# EAGLE design ESP32-Wrover-DevBoard (EAGLE 6.5.0)
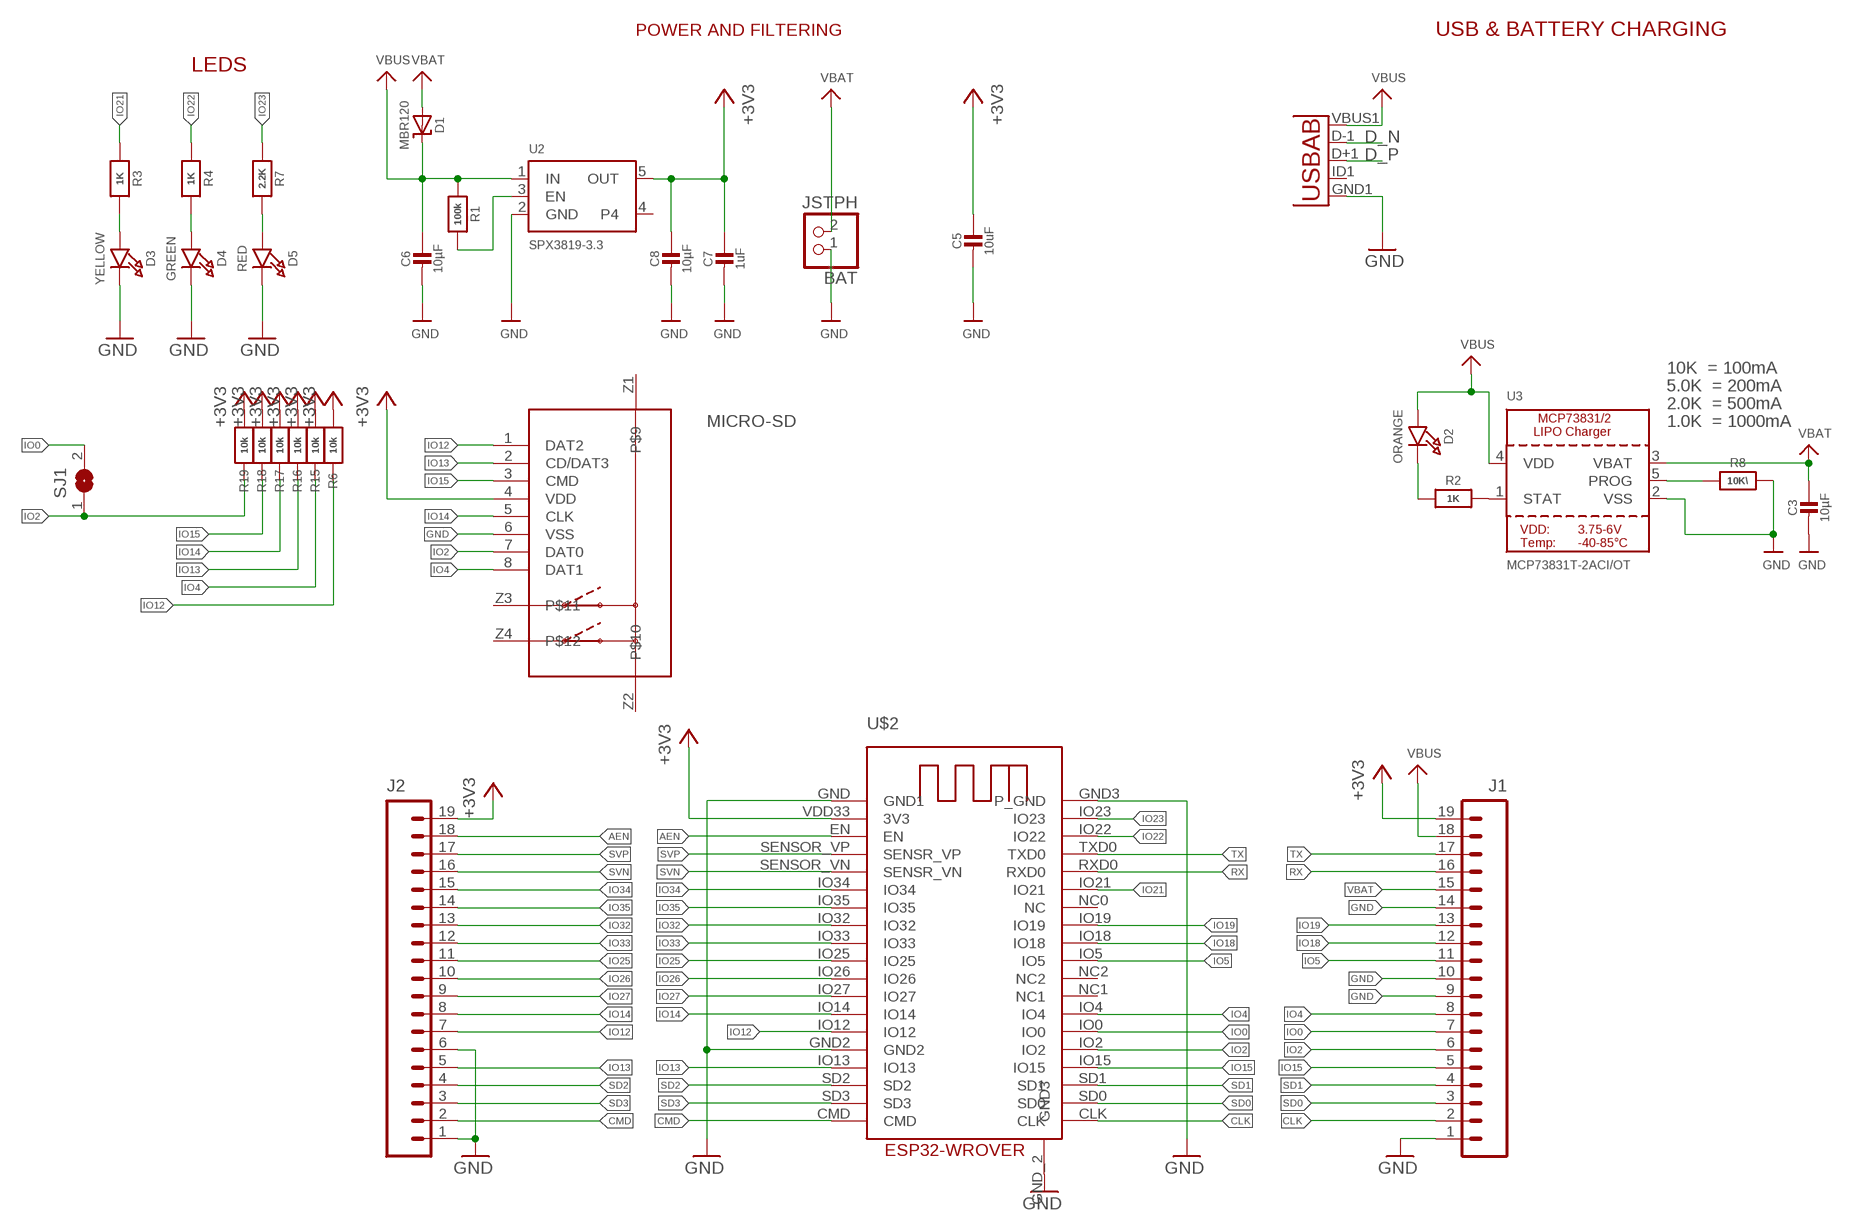
[diagram p0: schematic, sheet 1, part 1 of 2]
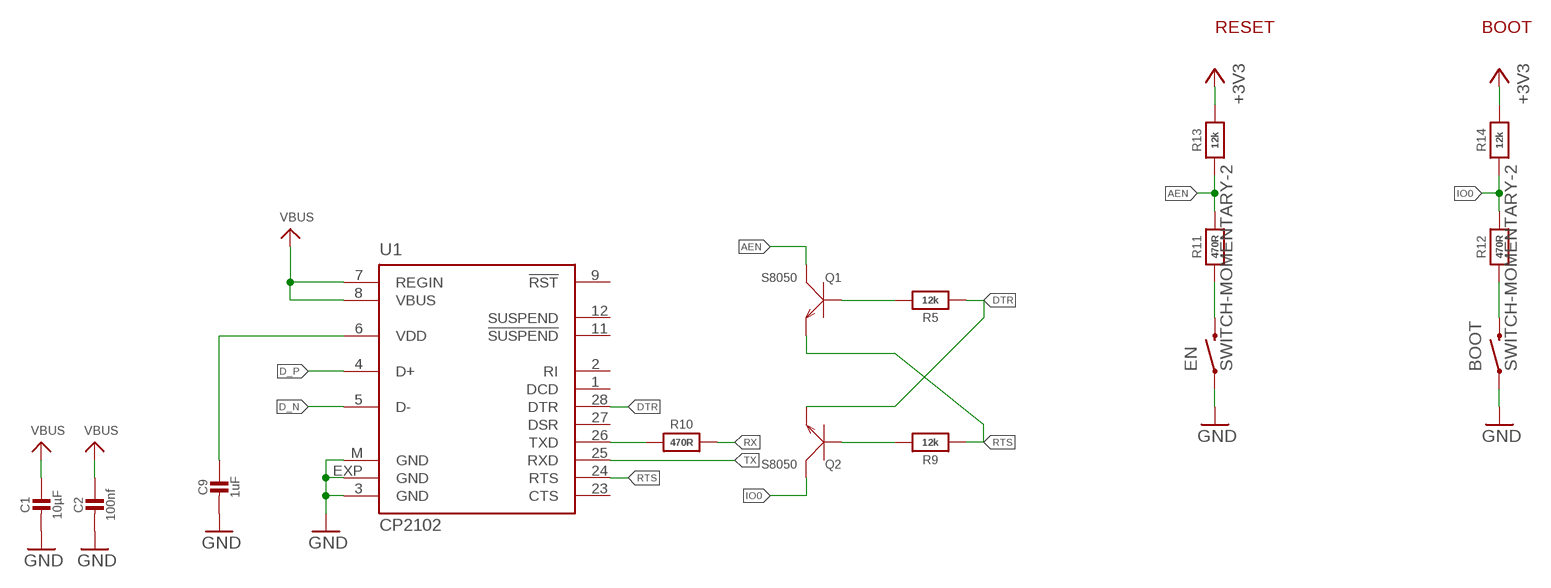
[diagram p1: schematic, sheet 1, part 2 of 2]

## Parts
BAT  JSTPH  CON_JST_PH_2PIN  [JSTPH2]
BOOT  SWITCH-MOMENTARY-2  [WS-TRS-6.0X3.5MM-TACT-SWITCH_SMD]
C1  10µF  CAP_CERAMIC0805-NOOUTLINE  [0805-NO]
C2  100nf  CAP_CERAMIC0603_NO  [0603-NO]
C3  10µF  CAP_CERAMIC0805-NOOUTLINE  [0805-NO]
C5  10uF  CAP_CERAMIC0805-NOOUTLINE  [0805-NO]
C6  10µF  CAP_CERAMIC0805-NOOUTLINE  [0805-NO]
C7  1uF  CAP_CERAMIC0603_NO  [0603-NO]
C8  10µF  CAP_CERAMIC0805-NOOUTLINE  [0805-NO]
C9  1uF  CAP_CERAMIC0603_NO  [0603-NO]
D1  MBR120  DIODE-SCHOTTKYSOD-123  [SOD-123]
D2  ORANGE  LED0805_NOOUTLINE  [CHIPLED_0805_NOOUTLINE]
D3  YELLOW  LED0805_NOOUTLINE  [CHIPLED_0805_NOOUTLINE]
D4  GREEN  LED0805_NOOUTLINE  [CHIPLED_0805_NOOUTLINE]
D5  RED  LED0805_NOOUTLINE  [CHIPLED_0805_NOOUTLINE]
EN  SWITCH-MOMENTARY-2  [WS-TRS-6.0X3.5MM-TACT-SWITCH_SMD]
J1  M191X19_NO_SILK  [1X19_NO_SILK]
J2  M191X19_NO_SILK  [1X19_NO_SILK]
M-USB  USB""  [USB-MICRO-SMD]
MICRO-SD  693072010801  [693072010801]
Q1  S8050  SMD-TRANSISTORS-NPN-25V-500MW-S8050(SOT-23)  [SOT-23]
Q2  S8050  SMD-TRANSISTORS-NPN-25V-500MW-S8050(SOT-23)  [SOT-23]
R1  100k  RESISTOR_0603_NOOUT  [0603-NO]
R2  1K  RESISTOR_0603_NOOUT  [0603-NO]
R3  1K  RESISTOR_0603_NOOUT  [0603-NO]
R4  1K  RESISTOR_0603_NOOUT  [0603-NO]
R5  12k  RESISTOR_0603_NOOUT  [0603-NO]
R6  10k  RESISTOR_0603_NOOUT  [0603-NO]
R7  2.2K  RESISTOR_0603_NOOUT  [0603-NO]
R8  10K\  RESISTOR_0603_NOOUT  [0603-NO]
R9  12k  RESISTOR_0603_NOOUT  [0603-NO]
R10  470R  RESISTOR_0603_NOOUT  [0603-NO]
R11  470R  RESISTOR_0603_NOOUT  [0603-NO]
R12  470R  RESISTOR_0603_NOOUT  [0603-NO]
R13  12k  RESISTOR_0603_NOOUT  [0603-NO]
R14  12k  RESISTOR_0603_NOOUT  [0603-NO]
R15  10k  RESISTOR_0603_NOOUT  [0603-NO]
R16  10k  RESISTOR_0603_NOOUT  [0603-NO]
R17  10k  RESISTOR_0603_NOOUT  [0603-NO]
R18  10k  RESISTOR_0603_NOOUT  [0603-NO]
R19  10k  RESISTOR_0603_NOOUT  [0603-NO]
SJ1  SJ  [SJ]
U1  CP2102  [MLP28]
U2  SPX3819-3.3  VREG_SOT23-5  [SOT23-5]
U3  MCP73831T-2ACI/OT  MCP73831/2  [SOT23-5]
U$2  ESP32-WROVER  [ESP32-WROVER]

## Nets
+3V3: C5.1 C7.1 C8.1 J1.19 J2.19 MICRO-SD.4(VDD) R6.1 R13.2 R14.2 R15.1 R16.1 R17.1 R18.1 R19.1 U2.5(OUT) U$2.VDD33(3V3)
AEN: J2.18 Q1.3(C) R11.2 R13.1 U$2.EN
CLK: J1.2 U$2.CLK
CMD: J2.2 U$2.CMD
D_N: M-USB.D-1(D-) U1.5(D-)
D_P: M-USB.D+1(D+) U1.4(D+)
DTR: Q2.2(E) R5.1 U1.28(DTR)
GND: BAT.1 BOOT.1 C1.2 C2.2 C3.2 C5.2 C6.2 C7.2 C8.2 C9.2 D3.C D4.C D5.C EN.1 J1.1 J1.9 J1.10 J1.14 J2.1 J2.6 M-USB.GND1(GND) MICRO-SD.6(VSS) R8.2 U1.3(GND) U1.EXP(GND) U1.M(GND) U2.2(GND) U3.2(VSS) U$2.GND2 U$2.GND3(P_GND) U$2.GND(GND1) U$2.GND_2(GND3)
IO0: J1.7 Q2.3(C) R12.2 R14.1 SJ1.2 U$2.IO0
IO2: J1.6 MICRO-SD.7(DAT0) R19.2 SJ1.1 U$2.IO2
IO4: J1.8 MICRO-SD.8(DAT1) R15.2 U$2.IO4
IO5: J1.11 U$2.IO5
IO12: J2.7 MICRO-SD.1(DAT2) R6.2 U$2.IO12
IO13: J2.5 MICRO-SD.2(CD/DAT3) R16.2 U$2.IO13
IO14: J2.8 MICRO-SD.5(CLK) R17.2 U$2.IO14
IO15: J1.5 MICRO-SD.3(CMD) R18.2 U$2.IO15
IO18: J1.12 U$2.IO18
IO19: J1.13 U$2.IO19
IO21: R3.1 U$2.IO21
IO22: R4.1 U$2.IO22
IO23: R7.1 U$2.IO23
IO25: J2.11 U$2.IO25
IO26: J2.10 U$2.IO26
IO27: J2.9 U$2.IO27
IO32: J2.13 U$2.IO32
IO33: J2.12 U$2.IO33
IO34: J2.15 U$2.IO34
IO35: J2.14 U$2.IO35
N$1: D2.C R2.1
N$2: D5.A R7.2
N$3: R2.2 U3.1(STAT)
N$4: R8.1 U3.5(PROG)
N$5: R10.1 U1.26(TXD)
N$6: D4.A R4.2
N$7: Q1.1(B) R5.2
N$8: Q2.1(B) R9.2
N$9: C9.1 U1.6(VDD)
N$10: EN.2 R11.1
N$11: BOOT.2 R12.1
N$12: D3.A R3.2
NX1: R1.2 U2.3(EN)
RTS: Q1.2(E) R9.1 U1.24(RTS)
RX: J1.16 R10.2 U$2.RXD0
SD0: J1.3 U$2.SD0
SD1: J1.4 U$2.SD1
SD2: J2.4 U$2.SD2
SD3: J2.3 U$2.SD3
SVN: J2.16 U$2.SENSOR_VN(SENSR_VN)
SVP: J2.17 U$2.SENSOR_VP(SENSR_VP)
TX: J1.17 U1.25(RXD) U$2.TXD0
VBAT [vbat]: BAT.2 C3.1 D1.A J1.15 U3.3(VBAT)
VBUS [vbat]: C1.1 C2.1 C6.1 D1.C D2.A J1.18 M-USB.VBUS1(VBUS) R1.1 U1.7(REGIN) U1.8(VBUS) U2.1(IN) U3.4(VDD)
Unconnected: M-USB.ID1(USBID) MICRO-SD.Z1 MICRO-SD.Z2 MICRO-SD.Z3 MICRO-SD.Z4 U1.1(DCD) U1.2(RI) U1.9(!RST) U1.11(!SUSPEND) U1.12(SUSPEND) U1.23(CTS) U1.27(DSR) U2.4 U$2.NC0(NC) U$2.NC1 U$2.NC2

## Notes on the sheet
- RESET | BOOT
- POWER AND FILTERING | USB & BATTERY CHARGING
- LEDS
- 10K  = 100mA
- 5.0K  = 200mA
- 2.0K  = 500mA
- 1.0K  = 1000mA

## Library data of the parts
BAT = microbuilder:CON_JST_PH_2PIN: JST 2-Pin Right-Angle Connector PH-Series - 4UConnector: 17311 SH-Series - 4UConnector: 07278
BOOT EN = SparkFun-Electromechanical:SWITCH-MOMENTARY-2: Various NO switches- pushbuttons, reed, etc Note: WS-TRS-6.0x3.5mm-Tact-Switch_SMD package belongs to https://www.conrad.de/de/drucktaster-12-vdc-005-a-1-x-ausein-wuerth-elektronik-ws-tsw-434111050826-tastend-1-st-711749.html?sc.ref=Product%20Details; CONRAD-WEB-LINK: https://www.conrad.de/de/drucktaster-12-vdc-005-a-1-x-ausein-wuerth-elektronik-ws-tsw-434111050826-tastend-1-st-711749.html?sc.ref=Product%20Details
C1-C3 C5-C9 = microbuilder:CAP_CERAMIC: Ceramic Capacitors For new designs, use the packages preceded by an '_' character since they are more reliable: The following footprints should be used on most boards: _0402 - Standard footprint for regular board layouts _0603 - Standard footprint for regular board layouts _0805 - Standard footprint for regular board layouts _1206 - Standard footprint for regular board layouts For extremely tight-pitch boards where space is at a premium, the following 'micro-pitch' footprints can be used (smaller pads, no silkscreen outline, etc.): _0402MP - Micro-pitch footprint for very dense/compact boards _0603MP - Micro-pitch footprint for very dense/compact boards _0805MP - Micro-pitch footprint for very dense/compact boards _1206MP - Micro-pitch footprint for very dense/compact boards
D1 = microbuilder:DIODE-SCHOTTKY
D2-D5 = microbuilder:LED: LED 0603 - 0603 Surface Mount Package 2mA: Green LED - Low Power (3.9mcd, 2ma, 1.7Vf) - Digikey: 475-2709-2-ND Orange LED - Low Power (9.8mcd, 2ma, 1.8Vf) - Digikey: 475-1194-2-ND Red LED - Low Power (5mcd, 2ma, 1.8Vf) - Digikey: 475-1195-2-ND Yellow LED - Low Power (7mcd, 2ma, 1.8Vf) - Digikey: 475-1196-2-ND 5mA: Blue LED - Low Power (17mcd, 5ma, 2.9Vf) - Digikey: LNJ937W8CRACT-ND 0805 - 0805 Surface Mount Package 2mA: Red LED (8.8mcd, 2mA, 1.8Vf, Clear) - Low Power [Digikey: 475-2510-1-ND] Green LED (5mcd, 2mA, 1.8Vf, Clear) - Low Power [Digikey: 475-2730-1-ND] Yellow LED (11.3mcd, 2mA, 1.8Vf, Clear) - Low Power [Digikey: 475-2555-1-ND] 20mA: Red LED (104mcd, 20mA, Diffused) - LS R976 [Digikey: 475-1278-6-ND] Red LED (12mcd, 20mA, 2.0Vf, Clear) - APT2012EC [Digikey: 754-1128-1-ND] Green LED (15mcd, 20mA, 2.2Vf, Clear) - APT2012GC [Digikey: 754-1131-1-ND] Orange LED (160mcd, 20mA, 2.1Vf, Clear) - APT2012SECK [Digikey: 754-1130-1-ND] 1206 - 1206 Surface Mount Package Green LED (26mcd, 20mA, Diffused) - LG N971 [Digikey: 475-1407-6-ND] Red LED (15mcd, 20mA, Diffused) - LH N974 [Digikey: 475-1416-6-ND] Cree - Cree High-Power Surface Mount LEDs XPEBWT-L1-0000-00D50 - White 111lm 350mA 2.9Vf 6200K 110° XTEAWT-00-0000-00000LEE3 - White 114lm 350mA 2.85Vf 5000K 115° Everlight - Everlight 45-21 Series Surface Mount LEDs 45-21/QK2C-B2832AC2CB2/2T - Warm White 2000mcd 20mA 3.25Vf 3050K 120° 45-21/LK2C-B38452C4CB2/2T - Nuetral White 2000mcd 20mA 3.25Vf 4150K 120° 45-21/LK2C-B50634C6CB2/2T - Cold White 2200mcd 20mA 3.25Vf 5650K 120° PLCC2 Reverse Mount LS T77K-J1L2-1-0-2-R18-Z - Red 11.25mcd 2mA 1.8Vf 630nm 120° LO T77K-L1M2-24-Z - Orange 19.6mcd 2mA 1.8Vf 606nm 120° LY T77K-K2M1-26-Z - Yellow 15.7mcd 2mA 1.8Vf 587nm 120°
J1 J2 = SparkFun-Connectors:M19: 1x19 .1" header
M-USB = MicroUSB:USB: This is a USB AB connector that is compatible with USB OTG. i.e. this connector can serve as a host or device..... Micro USB female connector, horizontal mounting 207A-BBA0-R Micro USB female connector TYP B Attend content ......... https://www.conrad.de/de/micro-usb-einbaubuchse-buchse-einbau-horizontal-207a-bba0-r-micro-usb-einbaubuchse-typ-b-attend-inhalt-1-st-1307069.html
MICRO-SD = Wurth_Elektronik_Electromechanic_Input-Output_Connectors_rev16b:693072010801: WR-CRD MICRO SD CARD CONNECTOR HINGE 8PINS=>Code : Con_I-O_COM_CRD_SD_Micro_696072010801 <http://katalog.we-online.de/media/images/eican/Con_I-O_COM_CRD_SD_Micro_696072010801_pf2.jpg> Details see: http://katalog.we-online.de/en/em/693_072_010_801 Created 2014-07-09, Karrer Zheng 2014 (C) Würth Elektronik; CONRAD-WEB-LINK: https://www.conrad.de/de/wr-crd-micro-sd-kartensockel-mit-deckel-8-pins-pole-8-wuerth-elektronik-inhalt-1-st-1088844.html
Q1 Q2 = Seeed-Transistor:SMD-TRANSISTORS-NPN-25V-500MW-S8050(SOT-23): 305010017; MPN: S8050
R1-R19 = microbuilder:RESISTOR: Resistors For new designs, use the packages preceded by an '_' character since they are more reliable: The following footprints should be used on most boards: _0402 - Standard footprint for regular board layouts _0603 - Standard footprint for regular board layouts _0805 - Standard footprint for regular board layouts _1206 - Standard footprint for regular board layouts For extremely tight-pitch boards where space is at a premium, the following 'micro-pitch' footprints can be used (smaller pads, no silkscreen outline, etc.): _0402MP - Micro-pitch footprint for very dense/compact boards _0603MP - Micro-pitch footprint for very dense/compact boards _0805MP - Micro-pitch footprint for very dense/compact boards _1206MP - Micro-pitch footprint for very dense/compact boards
SJ1 = jumper:SJ: SMD solder JUMPER
U1 = silabs:CP210*: Single-Chip USB to UART Bridge Source: www.silabs.com .. CP2101.pdf / cp2102.pdf; MF: FARNELL; MPN: CP2102-GM; OC_FARNELL: 9282130; OC_NEWARK: 30K5635
U2 = microbuilder:VREG_SOT23-5: SOT23-5 Fixed Voltage Regulators Part Current Out V Out V In V Dropout θJA (°C/W) TJ (°C) Digikey Part No. ADP121 150mA 3.3V 3.4-5.5V 0.09V @ 150mA -- -- ADP121-AUJZ33R7CT-ND ADP121 150mA 3.0V 3.1-5.5V 0.09V @ 150mA -- -- ADP121-AUJZ30R7CT-ND ADP122 300mA 3.3V 3.4-5.5V 0.085V @ 300mA -- -- ADP122AUJZ-3.3-R7CT-ND ADP1712 300mA 3.3V 3.5-5.5V 0.17V @ 300mA -- -- ADP1712AUJZ-3.3-R7TR-ND AP7311 (Low Cost) 150mA 3.3V 3.5-6V 0.15V @ 150mA -- -- AP7311-33WG-7DICT-ND LD39015M18R 150mA 1.8V 1.9V-5.5V 0.08V @ 100mA -- -- 497-6977-1-ND LP2985A-33DBVR 150mA 3.3V 3.3-16V 0.28V @ 150mA 206 150 296-18479-1-ND MCP1824T-3302E/OT 300mA 3.3V 3.5V-6V 0.2V @ 300mA -- -- MCP1824T-3302E/OTCT-ND MIC5205-2.5YM5 TR 150mA 2.5V 2.7-16V 0.165V @ 150mA -- -- 576-1257-2-ND MIC5205-3.0YM5 TR 150mA 3.0V 3.2V-16V 0.165V @ 150mA -- -- 576-1258-2-ND MIC5205-3.3YM5 TR 150mA 3.3V 3.5V-16V 0.165V @ 150mA -- -- 576-1259-2-ND TPS780330220 150mA 3.3V+2.2V 3.6-5.5V 250mV Max -- -- 296-23332-1-ND TDA3663/N1,135 100mA 3.3V 3.5-45V 0.18V @ 50mA -- -- 568-5343-1-ND Max operating temp can be calculated using θJA, TJ (max junction temperature), and power in watts. Set the "Maximum Ambient Temperature" until it reaches TJ ("Max Junction Temperature"), which is the absolute limit for safe use of the regulator: Heat Sink Temperature Calculator <http://www.daycounter.com/Calculators/Heat-Sink-Temperature-Calculator.phtml> For example, With 12V source into a 3.3V LP2985 and a 30mA load, we are dissipating (12V-3.3V) * 0.03A = 0.261W. With a θJA of 206 °C/W, a TJ of 150°C, and 261mW we can safely use the chip without a heat sink up to 75°C (=147.1°C Junction Temperature).
U3 = microbuilder:MCP73831/2: MCP73831/2 LIPO Charger VDD: 3.75 - 6V Temp -40 - 85°C Programmable Charge Rate: 15-500mA NOTE: STAT is a tri-state logic output on the MCP73831 and an open-drain output on the MCP73832. SOT23-5 with 4.2V output and tri-state logic on STAT = MCP73831T-2ACI/OT; CONRAD-WEB-LINK: https://www.conrad.de/de/pmic-batteriemanagement-microchip-technology-mcp73831t-2aciot-lademanagement-li-ion-li-pol-sot-23-5-oberflaechenmonta-651521.html
U$2 = ESP32-Wrover:ESP32-WROVER

## Net classes
1 vbat: width 0.254 mm, drill 0.305 mm, clearance 0.152 mm

## Board
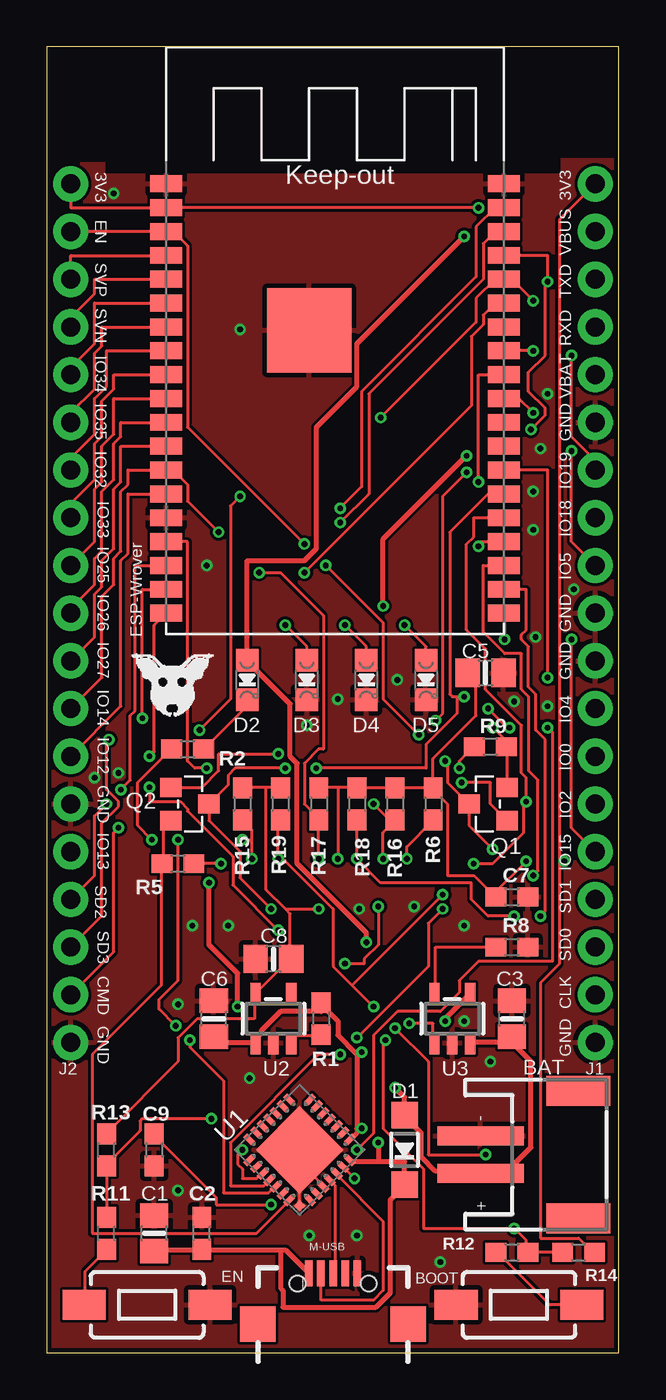
[diagram p2: board, top side]
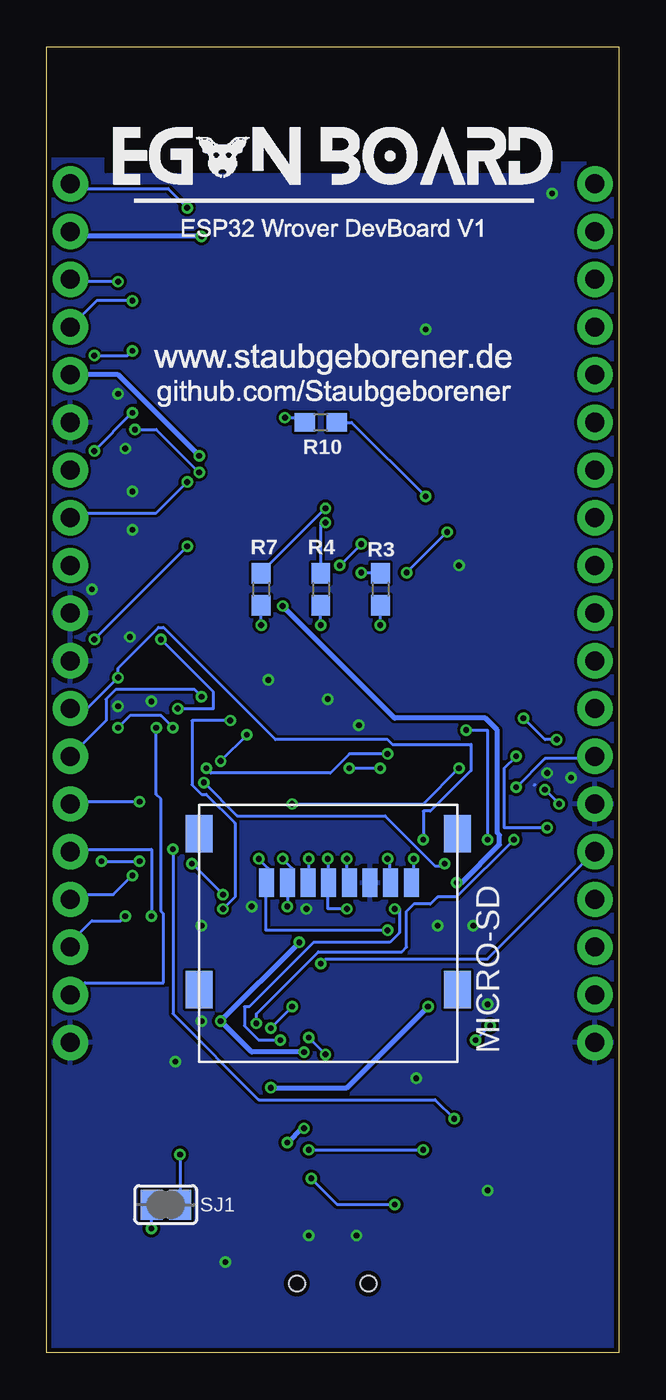
[diagram p3: board, bottom side, seen from below]

Size 30.46 x 69.52 mm. Coordinates in mm from the lower left corner, seen from the top.
Outline: 0,0 30.46,0 30.46,69.52 0,69.52 0,0
Copper layers (1*16): Top 0.035mm / dielectric 1.5mm / Bottom 0.035mm
Design rules "SeeedStudio_2layer_DRU_no_angle_20140221": minimum track width 6mil, minimum drill 12mil, track to track 6mil, track to pad 6mil, pad to pad 6mil, via to via 6mil, smd to smd 0mil, copper to edge 10mil, drill to drill 10mil, minimum pad ring 10mil, minimum via ring 6mil, stop-mask expansion 2mil, vias tented up to drill 100mil, thermal gap 10mil
tRestrict: 8 lines
bRestrict: 8 lines

### Footprints (pad centres in the part's own frame; a part is rotated, then mirrored left to right if it is on the bottom)
JSTPH2 = smd 1 x 4.6: 1 -1,-3.7; 2 1,-3.7 | smd 1.6 x 3.4: NC1 -3.4,1.5; NC2 3.4,1.5
WS-TRS-6.0X3.5MM-TACT-SWITCH_SMD = smd 2.3 x 1.6: 1 -3.35,0; 2 3.35,0
0805-NO = smd 1.3 x 1.5: 1 -0.95,0; 2 0.95,0
0603-NO = smd 1.1 x 1: 1 -0.85,0; 2 0.85,0
SOD-123 = smd 1.4 x 1.4: A 1.85,0; C -1.85,0
CHIPLED_0805_NOOUTLINE = smd 1.2 x 1.2: A 0,-1.05; C 0,1.05
1X19_NO_SILK = drill 1.016 pad 1.88: 1 0,0; 2 2.54,0; 3 5.08,0; 4 7.62,0; 5 10.16,0; 6 12.7,0; 7 15.24,0; 8 17.78,0; 9 20.32,0; 10 22.86,0; 11 25.4,0; 12 27.94,0; 13 30.48,0; 14 33.02,0; 15 35.56,0; 16 38.1,0; 17 40.64,0; 18 43.18,0; 19 45.72,0
USB-MICRO-SMD = smd 0.4 x 1.4: D+1 0,2.7; D-1 -0.65,2.7; GND1 1.3,2.7; ID1 0.65,2.7; VBUS1 -1.3,2.7 | smd 1.9 x 1.9: M 4,0; N -4,0 | hole 0.85: -1.9,2.15; 1.9,2.15
693072010801 = smd 0.8 x 1.5: 1 7.7,0; 2 6.6,0; 3 5.5,0; 4 4.4,0; 5 3.3,0; 6 2.2,0; 7 1.1,0; 8 0,0 | smd 1.45 x 2: Z1 -2.45,5.7; Z2 11.3,5.7; Z3 -2.45,-2.6; Z4 11.3,-2.6
SOT-23 = smd 1.016 x 1.143: 1 -0.889,-1.016; 2 0.889,-1.016; 3 0,1.016
SJ = smd 1.168 x 1.6: 1 -0.762,0; 2 0.762,0
MLP28 = smd 0.6 x 0.3: 1 -2.3,1.5; 2 -2.3,1; 3 -2.3,0.5; 4 -2.3,0; 5 -2.3,-0.5; 6 -2.3,-1; 7 -2.3,-1.5; 15 2.3,-1.5; 16 2.3,-1; 17 2.3,-0.5; 18 2.3,0; 19 2.3,0.5; 20 2.3,1; 21 2.3,1.5 | smd 0.3 x 0.6: 8 -1.5,-2.3; 9 -1,-2.3; 10 -0.5,-2.3; 11 0,-2.3; 12 0.5,-2.3; 13 1,-2.3; 14 1.5,-2.3; 22 1.5,2.3; 23 1,2.3; 24 0.5,2.3; 25 0,2.3; 26 -0.5,2.3; 27 -1,2.3; 28 -1.5,2.3 | smd 3.3 x 3.3: EXP 0,0 | smd 0.435 x 0.435: M -2.103,2.103
SOT23-5 = smd 0.55 x 1.2: 1 -0.95,-1.3; 2 0,-1.3; 3 0.95,-1.3; 4 0.95,1.3; 5 -0.95,1.3
ESP32-WROVER = smd 1.7 x 0.9: CLK 18,1.27; CMD 0,1.27; EN 0,21.59; GND 0,24.13; GND3 18,24.13; GND_2 0,6.35; IO0 18,7.62; IO2 18,6.35; IO4 18,8.89; IO5 18,12.7; IO12 0,7.62; IO13 0,5.08; IO14 0,8.89; IO15 18,5.08; IO18 18,13.97; IO19 18,15.24; IO21 18,17.78; IO22 18,21.59; IO23 18,22.86; IO25 0,12.7; IO26 0,11.43; IO27 0,10.16; IO32 0,15.24; IO33 0,13.97; IO34 0,17.78; IO35 0,16.51; NC0 18,16.51; NC1 18,10.16; NC2 18,11.43; RXD0 18,19.05; SD0 18,2.54; SD1 18,3.81; SD2 0,3.81; SD3 0,2.54; SENSOR_VN 0,19.05; SENSOR_VP 0,20.32; TXD0 18,20.32; VDD33 0,22.86 | smd 4.5 x 4.5: GND2 7.62,16.34

### Placement (x,y rotation side)
BAT  26.8,10.54 270 top
BOOT  25.15,2.54 0 top
C1  5.71,6.35 90 top
C2  8.26,6.35 90 top
C3  24.77,17.78 90 top
C5  23.37,36.2 0 top
C6  8.89,17.78 90 top
C7  24.77,24.26 0 top
C8  12.06,20.95 180 top
C9  5.71,10.79 270 top
D1  19.05,10.79 90 top
D2  10.67,35.81 180 top
D3  13.84,35.81 180 top
D4  17.02,35.81 180 top
D5  20.19,35.81 180 top
EN  5.33,2.54 180 top
J1  29.21,16.51 90 top
J2  1.27,16.51 90 top
M-USB  15.24,1.52 0 top
MICRO-SD  11.05,25.02 180 bottom
Q1  23.5,29.21 90 top
Q2  7.62,29.21 270 top
R1  14.61,17.78 270 top
R2  7.49,32.13 180 top
R3  12.7,40.64 270 bottom
R4  15.88,40.64 270 bottom
R5  6.99,26.04 0 top
R6  20.57,29.21 270 top
R7  19.05,40.64 270 bottom
R8  24.77,21.59 0 top
R9  23.62,32.26 180 top
R10  15.88,49.53 180 bottom
R11  3.17,6.35 90 top
R12  24.77,5.33 0 top
R13  3.17,10.79 90 top
R14  28.32,5.33 0 top
R15  10.41,29.21 270 top
R16  18.54,29.21 270 top
R17  14.48,29.21 270 top
R18  16.51,29.21 270 top
R19  12.45,29.21 270 top
SJ1  24.13,7.87 180 bottom
U1  13.46,10.79 135 top
U2  12.06,17.78 0 top
U3  21.59,17.78 0 top
U$2  6.35,38.1 0 top
U$8  [EGON-HEAD]  6.99,33.4 0 top
U$9  [EGON-LOGO-SCALE-0.5]  15.88,56.52 0 bottom

### Tracks (layer width: path | path; a pad name or v marks a point on that pad's centre or on a via)
+3V3  (via drill 0.3)
  Top 0.152: 16.51,30.1 15.49,30.1 | 15.49,30.1 14.48,30.1 R17.1 | 16.51,30.1 18.54,30.1 | 16.51,30.1 R18.1 | 18.54,30.1 20.57,30.1 | 18.54,30.1 R16.1 | 23.75,24.38 22.73,25.4 21.34,25.4 21.34,29.21 20.57,29.97 R6.1 20.57,30.1 | 23.75,24.38 23.88,24.26 C7.1 23.75,24.38 | 15.49,30.1 v15.49,26.29 | 20.57,30.1 20.57,31.62 22.86,33.91 22.86,36.2 C5.1 | 11.68,30.1 12.45,30.1 R19.1 | 11.68,30.1 10.41,30.1 R15.1 | R13.2 3.17,11.68 6.99,15.49 6.99,16.76 8,17.78 11.05,17.78 11.05,19.05 U2.5 11.18,19.18 12.95,20.95 | 11.68,30.1 11.68,24.64 12.7,23.62 | 12.7,23.62 12.95,23.37 12.95,20.95 | 12.95,20.95 C8.1 | 12.7,23.62 v14.48,23.62 | J2.19 1.27,60.96 U$2.VDD33 v22.99,60.96 | 27.3,26.16 27.3,60.33 J1.19 | 27.3,26.16 27.3,20.7 26.29,19.68 26.29,6.1 28.32,6.1 29.08,5.33 R14.2 | v25.53,26.16 23.75,24.38 | 27.3,26.16 v27.56,26.16
  Bottom 0.152: v15.49,26.29 15.49,25.02 | 15.49,25.02 15.49,23.62 v14.48,23.62 | 15.49,25.02 MICRO-SD.4 | v22.99,60.96 24,61.98 28.96,61.98 J1.19 | v27.56,26.16 v25.53,26.16
AEN  (via drill 0.3)
  Top 0.152: R11.2 R13.1 3.17,10.03 4.95,11.81 4.95,12.32 5.08,12.45 v8.76,12.45 | v21.21,31.5 21.34,31.37 21.34,30.35 Q1.3 22.48,28.07 v23.75,26.8 | v19.81,32.89 17.91,34.8 17.91,38.86 v14.86,41.91 | v13.72,43.05 7.49,49.28 7.49,58.93 6.73,59.69 U$2.EN J2.18
  Bottom 0.152: v19.81,32.89 v21.21,31.5 | v13.72,43.05 v14.86,41.91 | v8.76,12.45 9.78,13.46 19.18,13.46 23.75,18.03 v23.75,26.8
CLK  (via drill 0.3)
  Top 0.152: v24.38,37.97 24.38,39.37 U$2.CLK | v23.5,34.29 24.51,33.27 v24.64,33.27
  Bottom 0.152: v24.38,37.97 21.59,35.18 21.59,34.29 v23.5,34.29 | v24.64,33.27 24.64,29.72 24.38,29.46 24.38,23.5 24.26,23.37 24.26,19.68 28.45,19.68 29.08,19.05 J1.2
CMD  (via drill 0.3)
  Top 0.152: U$2.CMD 5.71,38.73 5.71,32 v5.46,31.75 | v3.81,27.94 3.56,27.69 3.56,21.34 J2.2
  Bottom 0.152: v5.46,31.75 6.1,31.11 6.1,27.94 v3.81,27.94
D_N
  Top 0.152: U1.5 15.49,9.4 17.91,6.99 17.91,3.3 17.4,2.79 14.61,2.79 14.61,4.19 M-USB.D-1
D_P
  Top 0.152: U1.4 15.11,9.14 15.37,8.89 15.37,4.45 15.24,4.32 M-USB.D+1
DTR
  Top 0.152: U1.28 12.83,8 11.18,6.35 2.41,6.35 2.41,15.88 6.1,19.56 6.1,26.04 R5.1 6.22,26.04 6.22,27.94 Q2.2
GND  (via drill 0.3)
  Top 0.152: U1.M 13.46,10.16 | 13.46,10.16 14.73,8.89 U1.3 | 13.46,10.16 U1.EXP
  Bottom 0.152: 1.27,29.72 J2.6 | 4.45,30.23 4.52,30.21
  other vias: 20.95,4.83 16.51,6.22 13.97,6.22 6.99,8.64 22.23,22.73 23.62,15.49 22.23,17.65 10.79,14.61 2.54,30.61 6.99,18.54 9.65,22.73 7.75,22.73 3.56,61.72 10.29,54.48 8.51,41.91 18.67,35.81 15.49,34.8 13.84,33.4 26.29,48.13 24.89,34.67 16.64,23.62 19.56,23.75 3.81,30.86 26.67,51.05 28.07,40.64 25.91,43.81 25.91,45.85 26.04,38.1 26.67,34.42
  pour Top: -0.64,63.5 31.11,63.5 31.11,41.91 31.11,8.89 31.11,-0.64 -0.64,-0.64
  pour Bottom: -0.64,63.5 31.11,63.5 31.11,41.91 31.11,8.89 31.11,-0.64 -0.64,-0.64
IO0  (via drill 0.3)
  Top 0.152: R14.1 R12.2 25.53,5.33 25.53,5.97 v24.89,6.6 20.07,6.6 20.07,9.78 17.91,11.94 17.91,16.51 v18.03,16.64 | v12.7,31.11 10.03,31.11 9.65,30.73 9.65,30.23 Q2.3 8.64,28.32 10.29,26.67 10.29,25.27 v11.94,23.62 | v14.35,31.11 20.19,31.11 20.19,32.38 21.84,34.04 21.84,34.92 v22.23,34.92 21.59,34.92 21.46,35.05 21.46,43.69 23.5,45.72 U$2.IO0
  Bottom 0.152: v24.89,6.6 SJ1.2 | v14.35,31.11 v12.7,31.11 | v18.03,16.64 19.18,16.64 19.94,17.4 19.94,18.41 19.68,18.41 16.26,21.84 12.19,21.84 11.68,22.35 11.68,23.62 v11.94,23.62 | J1.7 27.3,33.66 27.3,34.8 26.8,35.31 22.61,35.31 v22.23,34.92
IO2  (via drill 0.3)
  Top 0.152: U$2.IO2 22.73,44.45 22.73,43.43 22.35,43.05 22.35,38.48 23.37,37.47 23.37,35.31 25.27,33.4 25.27,30.86 25.53,30.61 v25.53,29.34 25.4,29.21 25.4,27.69 23.75,26.04 v22.73,26.04 | 12.32,26.54 12.32,28.19 12.45,28.32 R19.2 | v23.37,10.54 20.32,10.54 20.32,15.49 v18.54,17.27 | 16.26,19.56 15.24,20.57 15.24,23.62 12.32,26.54 | 16.26,19.56 v17.4,18.41 | 12.32,26.54 v12.32,26.29 | 16.26,19.56 v21.08,24.38
  Bottom 0.152: v25.53,29.34 29.08,29.34 J1.6 | v12.32,26.29 12.19,26.16 12.19,25.02 MICRO-SD.7 | v23.37,10.54 SJ1.1 | v17.4,18.41 v18.54,17.27 | v21.08,24.38 v22.73,26.04
IO4  (via drill 0.3)
  Top 0.152: v10.92,26.29 10.92,27.3 | 10.92,27.3 10.92,27.81 10.41,28.32 R15.2 | U$2.IO4 26.67,46.99 v26.67,35.94 | v10.41,27.3 10.92,27.3
  Bottom 0.152: v10.92,26.29 10.92,25.02 MICRO-SD.8 | J1.8 28.32,34.29 v26.67,35.94 26.67,36.45 24.51,38.61 24.26,38.61 18.29,32.64 12.32,32.64 12.06,32.38 7.87,32.38 7.87,30.99 10.03,28.83 10.41,28.83 v10.41,27.3
IO5  (via drill 0.3)
  Top 0.152: v27.94,48.01 27.94,43.18 J1.11 | v25.91,50.04 25.15,50.8 U$2.IO5
  Bottom 0.152: v27.94,48.01 v25.91,50.04
IO12  (via drill 0.3)
  Top 0.152: v19.18,26.29 19.18,26.92 20.57,28.32 R6.2 | U$2.IO12 4.32,45.72 4.32,42.55 3.94,42.16 3.94,34.42 J2.7 | v12.32,22.48 9.91,24.89 9.91,26.42 7.49,28.83 7.49,28.96 7.11,29.34 5.46,29.34 v5.46,30.1
  Bottom 0.152: v19.18,26.29 18.67,25.78 18.67,25.02 MICRO-SD.1 18.8,25.02 18.8,22.48 v12.32,22.48 | v5.46,30.1 3.94,31.62 1.4,31.62 J2.7
IO13  (via drill 0.3)
  Top 0.152: 18.41,28.19 17.91,27.69 v17.91,26.29 | 18.41,28.19 18.54,28.32 R16.2 18.41,28.19 | U$2.IO13 7.49,43.18 7.49,31.5 7.87,31.11 v8.51,31.11 | 18.41,28.19 v17.4,29.21 | v15.88,20.7 16.89,20.7 16.89,20.95 17.65,21.72 v17.65,23.75
  Bottom 0.152: v17.91,26.29 17.4,25.78 17.4,25.02 MICRO-SD.2 v17.65,23.75 | v8.51,31.11 10.41,29.21 v17.4,29.21 | J2.5 6.99,20.95 15.62,20.95 v15.88,20.7
IO14  (via drill 0.3)
  Top 0.152: v14.48,26.29 R17.2 14.48,28.45 13.72,29.21 13.72,31.37 14.48,32.13 14.73,32.13 14.73,39.24 12.45,41.53 v11.3,41.53 | J2.8 2.92,35.94 2.92,40.26 3.56,40.89 3.56,42.29 3.94,42.67 3.94,45.85 4.32,46.23 4.32,46.99 U$2.IO14 6.73,46.99 7.49,46.23 7.49,45.34 v9.14,43.69
  Bottom 0.152: v14.48,26.29 14.48,25.02 MICRO-SD.5 | v9.14,43.69 v11.3,41.53
IO15  (via drill 0.3)
  Top 0.152: R18.2 v16.51,26.29 17.78,25.02 22.61,25.02 22.61,24.13 23.5,23.24 v24.89,23.24 | U$2.IO15 22.99,43.18 v22.99,42.93 | v27.94,37.97 27.94,27.94 J1.5
  Bottom 0.152: v16.51,26.29 16.51,25.02 MICRO-SD.3 | v27.94,37.97 v22.99,42.93 | v24.89,23.24 24.89,26.8 29.08,26.8 J1.5
IO18  (via drill 0.3)
  Top 0.152: U$2.IO18 22.99,52.07 v22.99,46.35
  Bottom 0.152: v22.99,46.35 24.64,44.7 28.96,44.7 J1.12
IO19  (via drill 0.3)
  Top 0.152: v25.91,53.34 U$2.IO19 | v27.94,53.09 27.94,48.77 29.21,47.5 J1.13
  Bottom 0.152: v25.91,53.34 26.16,53.09 v27.94,53.09
IO21  (via drill 0.3)
  Top 0.152: v13.72,41.53 22.61,50.42 22.61,54.1 23.24,54.74 23.24,55.24 23.88,55.88 U$2.IO21
  Bottom 0.152: v13.72,41.53 12.7,41.53 R3.1
IO22  (via drill 0.3)
  Top 0.152: v15.62,44.2 17.14,45.72 17.14,51.05 23.24,57.15 23.24,59.05 23.88,59.69 U$2.IO22
  Bottom 0.152: R4.1 15.88,44.2 v15.62,44.2
IO23  (via drill 0.3)
  Top 0.152: v15.62,44.96 16.76,46.1 16.76,51.18 22.86,57.28 22.86,59.94 23.88,60.96 U$2.IO23
  Bottom 0.152: v15.62,44.96 19.05,41.53 R7.1
IO25
  Top 0.152: U$2.IO25 3.56,50.8 3.56,48.9 2.92,48.26 2.92,46.35 2.54,45.97 2.54,43.18 J2.11
IO26
  Top 0.152: U$2.IO26 3.94,49.53 3.94,48.77 3.56,48.39 3.56,46.48 2.92,45.85 2.92,42.67 2.54,42.29 2.54,40.89 1.27,39.62 J2.10
IO27
  Top 0.152: U$2.IO27 3.94,48.26 3.94,46.35 3.56,45.97 3.56,42.8 2.92,42.16 2.92,40.77 2.54,40.39 2.54,38.1 J2.9
IO32
  Top 0.152: U$2.IO32 3.17,53.34 3.17,51.44 2.54,50.8 2.54,48.9 1.27,47.62 J2.13
IO33
  Top 0.152: U$2.IO33 3.56,52.07 3.56,51.31 2.92,50.67 2.92,48.77 2.54,48.39 2.54,46.48 1.27,45.21 J2.12
IO34
  Top 0.152: U$2.IO34 2.54,55.88 2.54,53.72 1.27,52.45 J2.15
IO35
  Top 0.152: U$2.IO35 2.92,54.61 2.92,53.59 2.54,53.21 2.54,51.31 1.27,50.04 J2.14
N$1
  Top 0.152: D2.C 10.67,34.42 8.38,32.13 R2.1
N$2  (via drill 0.3)
  Top 0.152: v19.05,38.73 20.19,37.59 D5.A
  Bottom 0.152: v19.05,38.73 R7.2
N$3  (via drill 0.3)
  Top 0.152: v5.59,27.3 4.83,28.07 4.83,30.35 6.6,32.13 R2.2 | v19.3,17.53 20.57,17.53 20.57,16.51 U3.1
  Bottom 0.152: v19.3,17.53 19.3,18.03 16,21.34 11.56,21.34 11.3,21.59 11.3,23.5 10.92,23.88 10.03,23.88 9.65,24.26 8.64,24.26 v5.59,27.3
N$4
  Top 0.152: R8.1 20.7,21.59 20.7,19.18 U3.5
N$5  (via drill 0.3)
  Top 0.152: v7.62,16.64 7.62,16.26 9.4,14.48 9.4,8.51 11.81,8.51 12.06,8.76 U1.26 | v8.13,33.15 9.78,34.8 9.78,45.09 v10.29,45.59 | v6.86,17.4 5.97,18.29 5.97,18.8 6.99,19.81 v6.99,27.3
  Bottom 0.152: v6.86,17.4 v7.62,16.64 | v6.99,27.3 6.99,33.15 v8.13,33.15 | v10.29,45.59 14.22,49.53 R10.1
N$6  (via drill 0.3)
  Top 0.152: v15.88,38.73 17.02,37.59 D4.A
  Bottom 0.152: v15.88,38.73 R4.2
N$7  (via drill 0.3)
  Top 0.152: v9.27,26.04 R5.2 | v22.1,30.35 23.62,30.35 23.62,29.21 Q1.1
  Bottom 0.152: v9.27,26.04 9.4,25.91 9.78,25.91 12.45,28.57 20.32,28.57 v22.1,30.35
N$8  (via drill 0.3)
  Top 0.152: v21.97,31.11 21.97,31.5 22.73,32.26 R9.2 | v12.32,31.88 9.14,31.88 9.14,30.99 8.26,30.1 Q2.1
  Bottom 0.152: v21.97,31.11 21.72,30.86 15.37,30.86 14.35,31.88 v12.32,31.88
N$9  (via drill 0.3)
  Top 0.152: v16.38,9.27 15.88,9.78 U1.6 | v11.94,7.87 9.02,7.87 9.02,8.26 5.71,11.56 C9.1
  Bottom 0.152: v16.38,9.27 14.99,7.87 v11.94,7.87
N$10
  Top 0.152: R11.1 3.17,5.46 2.03,4.32 2.03,2.54 EN.2
N$11
  Top 0.152: BOOT.2 26.8,2.54 24,5.33 R12.1
N$12  (via drill 0.3)
  Top 0.152: v12.7,38.73 13.84,37.59 D3.A
  Bottom 0.152: v12.7,38.73 R3.2
NX1
  Top 0.152: R1.2 14.61,16.89 13.08,16.89 13.08,16.51 U2.3
RTS  (via drill 0.3)
  Top 0.152: v10.41,10.79 10.16,10.54 10.16,10.03 10.41,9.78 10.41,9.27 11.18,9.27 11.3,9.4 11.43,9.4 U1.24 | v16.51,10.79 17.4,11.68 17.4,16.89 18.67,18.16 20.95,18.16 21.97,19.18 21.97,19.81 22.99,20.83 26.92,20.83 26.92,33.02 v26.67,33.27 | v23.75,33.27 24.38,32.64 24.38,32.26 R9.1 24.51,32.26 Q1.2
  Bottom 0.152: v16.51,10.79 v10.41,10.79 | v26.67,33.27 26.04,33.91 24.38,33.91 v23.75,33.27
RX  (via drill 0.3)
  Top 0.152: v17.78,49.78 22.86,54.86 22.86,56.13 23.88,57.15 U$2.RXD0 24.77,57.15 v25.91,56.01
  Bottom 0.152: v17.78,49.78 17.02,49.78 16.76,49.53 R10.2 | J1.16 27.81,56.01 v25.91,56.01
SD0  (via drill 0.3)
  Top 0.152: U$2.SD0 25.53,40.64 25.53,38.48 25.27,38.23 25.27,37.97 25.65,37.59 25.65,35.43 26.04,35.05 26.04,33.15 26.54,32.64 26.54,23.5 v26.29,23.24
  Bottom 0.152: v26.29,23.24 26.54,22.99 28.07,22.99 29.21,21.84 J1.3
SD1  (via drill 0.3)
  Top 0.152: U$2.SD1 23.24,41.91 23.24,38.35 24.38,37.21 25.27,37.21 25.27,35.31 25.65,34.92 25.65,30.99 26.16,30.48 26.16,25.65 v25.91,25.4
  Bottom 0.152: v25.91,25.4 26.92,24.38 28.96,24.38 J1.4
SD2  (via drill 0.3)
  Top 0.152: U$2.SD2 4.7,41.91 4.7,34.16 4.45,33.91 4.45,30.48 v3.94,29.97 | v3.17,29.21 2.54,28.57 2.54,25.4 J2.4
  Bottom 0.152: v3.17,29.21 v3.94,29.97
SD3  (via drill 0.3)
  Top 0.152: U$2.SD3 5.08,40.64 v5.08,33.78 | v3.3,32.64 3.17,32.51 3.17,29.97 3.81,29.34 3.81,29.08 2.92,28.19 2.92,23.24 J2.3
  Bottom 0.152: v5.08,33.78 3.94,32.64 v3.3,32.64
SVN
  Top 0.152: U$2.SENSOR_VN 2.54,57.15 2.54,56.39 1.27,55.12 J2.16
SVP
  Top 0.152: U$2.SENSOR_VP 1.27,58.42 J2.17
TX  (via drill 0.3)
  Top 0.152: U1.25 11.56,8.89 9.78,8.89 9.78,11.18 14.48,15.88 v15.62,15.88 | v16.51,16.76 20.32,20.57 20.32,22.86 v21.08,23.62 | v22.35,46.86 21.08,45.59 21.08,34.04 v20.7,33.66 | v25.78,49.15 26.54,49.91 26.54,50.29 25.65,51.18 25.65,52.2 26.54,53.09 26.54,56.9 v26.67,57.02 26.67,58.42 U$2.TXD0
  Bottom 0.152: v16.51,16.76 v15.62,15.88 | v21.08,23.62 20.45,24.26 20.45,28.19 21.97,29.72 22.23,29.72 22.73,30.23 22.73,33.66 v20.7,33.66 | v22.35,46.86 24.64,49.15 v25.78,49.15 | J1.17 29.08,57.02 v26.67,57.02
VBAT  (via drill 0.3)
  Top 0.254: 22.61,16.51 U3.3 22.73,16.51 24.77,16.51 | 24.77,16.51 C3.1 24.77,16.76 | 24.77,16.51 25.78,15.49 25.78,10.92 24.51,9.65 23.11,9.65 BAT.2 22.99,9.65 20.7,9.65 19.94,10.41 19.94,11.68 19.05,12.57 D1.A 19.05,13.59 v18.54,14.1 | v22.35,47.75 17.91,43.31 v17.91,39.75 | v10.16,18.41 10.16,20.19 8.64,21.72 v8.64,25.02
  Bottom 0.254: v22.35,47.75 26.67,52.07 J1.15 | v17.91,39.75 11.94,33.78 7.11,33.78 6.48,33.15 6.48,27.69 6.35,27.56 6.35,27.05 8.38,25.02 v8.64,25.02 | v10.16,18.41 14.48,14.1 v18.54,14.1
VBUS  (via drill 0.3)
  Top 0.254: 17.65,10.16 19.05,10.16 D1.C 19.05,8.89 18.29,8.13 18.29,3.17 17.53,2.41 12.57,2.41 12.57,3.3 12.45,3.43 12.45,5.46 | 17.65,10.16 16.26,10.16 U1.7 | 8.26,5.46 5.71,5.46 C1.1 | 8.26,5.46 12.45,5.46 | 12.45,5.46 12.7,5.46 13.84,4.32 M-USB.VBUS1 | 8.26,5.46 C2.1 | C6.1 8.89,16.51 11.05,16.51 U2.1 11.05,16.64 11.43,17.02 11.43,17.14 12.45,18.16 14.61,18.16 R1.1 14.61,18.54 15.49,17.65 15.49,16.89 16.45,15.94 | 16.51,11.94 16.51,15.88 16.45,15.94 | 16.51,11.94 16.51,11.68 16.26,11.43 U1.8 | v21.21,17.65 21.21,17.78 22.48,19.05 U3.4 | v16.76,16 16.51,16 16.45,15.94 | v17.02,21.84 17.02,22.35 13.34,26.04 13.34,31.37 12.95,31.75 12.95,34.54 10.67,36.83 D2.A 10.67,42.16 13.72,42.16 14.35,42.8 14.35,49.28 16.51,51.44 16.51,53.72 v22.23,59.44 | v17.65,11.18 17.65,10.16 | 16.51,11.94 v16.76,11.94
  Bottom 0.254: v16.76,16 19.56,16 v21.21,17.65 v17.02,21.84 | J1.18 28.96,59.44 v22.23,59.44 | v17.65,11.18 16.89,11.94 v16.76,11.94

### Text on the board
tPlace: 3V3 | 3V3 | EN | SVP | VBUS | SVN | TXD | RXD | IO34 | IO35 | VBAT | GND | IO32 | IO19 | IO33 | IO25 | IO18 | IO5 | IO26 | IO27 | ESP-Wrover | GND | GND | IO14 | IO4 | IO12 | IO0 | GND | IO13 | IO2 | IO15 | SD2 | SD1 | SD3 | SD0 | CMD | CLK | GND | GND | - | +